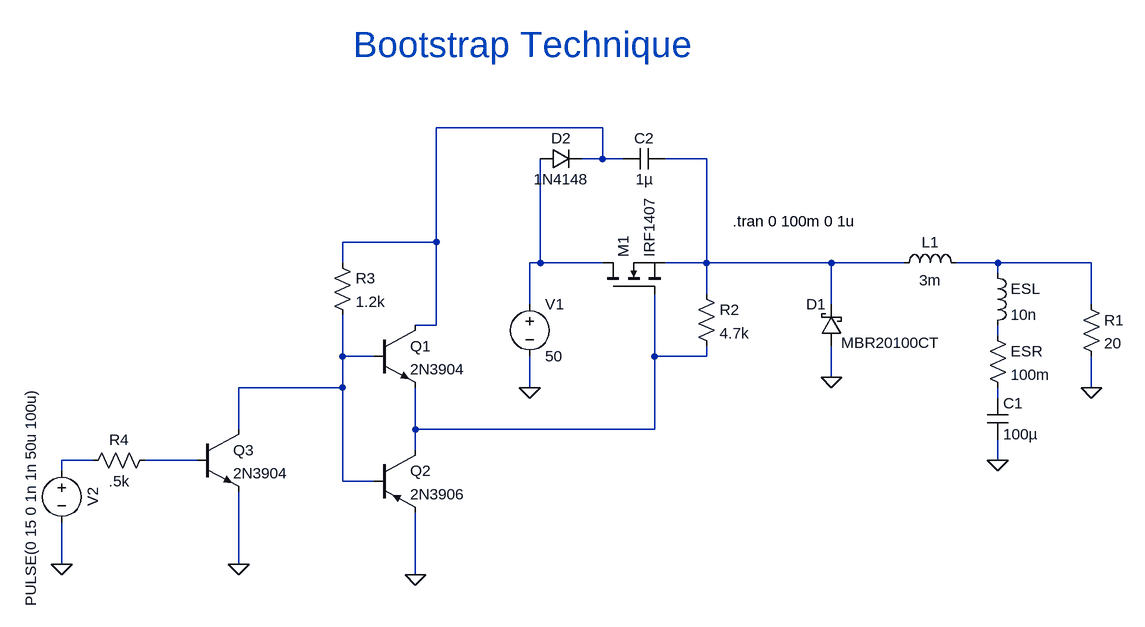
[diagram p0: schematic 02-buckConverterBootstrap.asc]
02-buckConverterBootstrap.asc, the LTspice schematic file:
Version 4
SHEET 1 884 804
WIRE 64 -144 -192 -144
WIRE 64 -96 64 -144
WIRE 64 -96 32 -96
WIRE 96 -96 64 -96
WIRE 224 -96 160 -96
WIRE -192 32 -192 -144
WIRE -192 32 -336 32
WIRE -336 64 -336 32
WIRE -32 64 -32 -96
WIRE -32 64 -48 64
WIRE 64 64 -32 64
WIRE 224 64 224 -96
WIRE 224 64 160 64
WIRE 416 64 224 64
WIRE 528 64 416 64
WIRE 672 64 608 64
WIRE 816 64 672 64
WIRE 672 80 672 64
WIRE 224 112 224 64
WIRE -48 128 -48 64
WIRE 416 128 416 64
WIRE 816 128 816 64
WIRE -192 160 -192 32
WIRE -192 160 -224 160
WIRE 672 176 672 160
WIRE -336 208 -336 144
WIRE -288 208 -336 208
WIRE 144 208 144 112
WIRE 224 208 224 192
WIRE 224 208 144 208
WIRE 416 240 416 192
WIRE -336 256 -336 208
WIRE -336 256 -496 256
WIRE -48 256 -48 208
WIRE 816 256 816 208
WIRE 672 272 672 256
WIRE -496 320 -496 256
WIRE -224 320 -224 256
WIRE 144 320 144 208
WIRE 144 320 -224 320
WIRE -224 352 -224 320
WIRE -720 368 -768 368
WIRE -560 368 -640 368
WIRE 672 368 672 336
WIRE -768 384 -768 368
WIRE -336 400 -336 256
WIRE -288 400 -336 400
WIRE -768 528 -768 464
WIRE -496 528 -496 416
WIRE -224 544 -224 448
FLAG 416 240 0
FLAG 672 368 0
FLAG 816 256 0
FLAG -48 256 0
FLAG -224 544 0
FLAG -768 528 0
FLAG -496 528 0
SYMBOL schottky 432 192 R180
WINDOW 0 24 64 Left 2
WINDOW 3 -152 5 Left 2
SYMATTR InstName D1
SYMATTR Value MBR20100CT
SYMATTR Description Diode
SYMATTR Type diode
SYMBOL voltage -48 112 R0
WINDOW 123 0 0 Left 0
WINDOW 39 0 0 Left 0
SYMATTR InstName V1
SYMATTR Value 50
SYMBOL ind 512 80 R270
WINDOW 0 32 56 VTop 2
WINDOW 3 5 56 VBottom 2
SYMATTR InstName L1
SYMATTR Value 3m
SYMBOL cap 656 272 R0
SYMATTR InstName C1
SYMATTR Value 100µ
SYMBOL res 800 112 R0
SYMATTR InstName R1
SYMATTR Value 20
SYMBOL nmos 64 112 R270
SYMATTR InstName M1
SYMATTR Value IRF1407
SYMBOL voltage -768 368 R0
WINDOW 0 32 56 VTop 2
WINDOW 3 -32 56 VBottom 2
WINDOW 123 0 0 Left 0
WINDOW 39 0 0 Left 0
SYMATTR InstName V2
SYMATTR Value PULSE(0 15 0 1n 1n 50u 100u)
SYMBOL res 656 160 R0
SYMATTR InstName ESR
SYMATTR Value 100m
SYMBOL ind 656 64 R0
SYMATTR InstName ESL
SYMATTR Value 10n
SYMBOL npn -288 160 R0
SYMATTR InstName Q1
SYMATTR Value 2N3904
SYMBOL pnp -288 352 R0
SYMATTR InstName Q2
SYMATTR Value 2N3906
SYMBOL diode -32 -80 R270
WINDOW 0 32 32 VTop 2
WINDOW 3 0 32 VBottom 2
SYMATTR InstName D2
SYMATTR Value 1N4148
SYMBOL cap 160 -112 R90
WINDOW 0 0 32 VBottom 2
WINDOW 3 32 32 VTop 2
SYMATTR InstName C2
SYMATTR Value 1µ
SYMBOL res 208 96 R0
SYMATTR InstName R2
SYMATTR Value 4.7k
SYMBOL res -352 48 R0
SYMATTR InstName R3
SYMATTR Value 1.2k
SYMBOL res -624 352 R90
WINDOW 0 0 56 VBottom 2
WINDOW 3 32 56 VTop 2
SYMATTR InstName R4
SYMATTR Value .5k
SYMBOL npn -560 320 R0
SYMATTR InstName Q3
SYMATTR Value 2N3904
TEXT 264 0 Left 2 !.tran 0 100m 0 1u
TEXT -320 -272 Left 5 ;Bootstrap Technique

The netlist it stands for:
* 02-buckConverterBootstrap.asc
D1 0 N002 MBR20100CT
V1 N003 0 50
L1 N002 N004 3m
C1 N008 0 100µ
R1 N004 0 20
M1 N003 N007 N002 N002 IRF1407
V2 N009 0 PULSE(0 15 0 1n 1n 50u 100u)
R§ESR N005 N008 100m
L§ESL N004 N005 10n
Q1 N001 N006 N007 0 2N3904
Q2 N007 N006 0 0 2N3906
D2 N003 N001 1N4148
C2 N002 N001 1µ
R2 N002 N007 4.7k
R3 N001 N006 1.2k
R4 N010 N009 .5k
Q3 N006 N010 0 0 2N3904
.model D D
.lib standard.dio
.model NPN NPN
.model PNP PNP
.lib standard.bjt
.model NMOS NMOS
.model PMOS PMOS
.lib standard.mos
.tran 0 100m 0 1u
* Bootstrap Technique
.backanno
.end